# Altium schematic sheet PLL.SchDoc
size A4
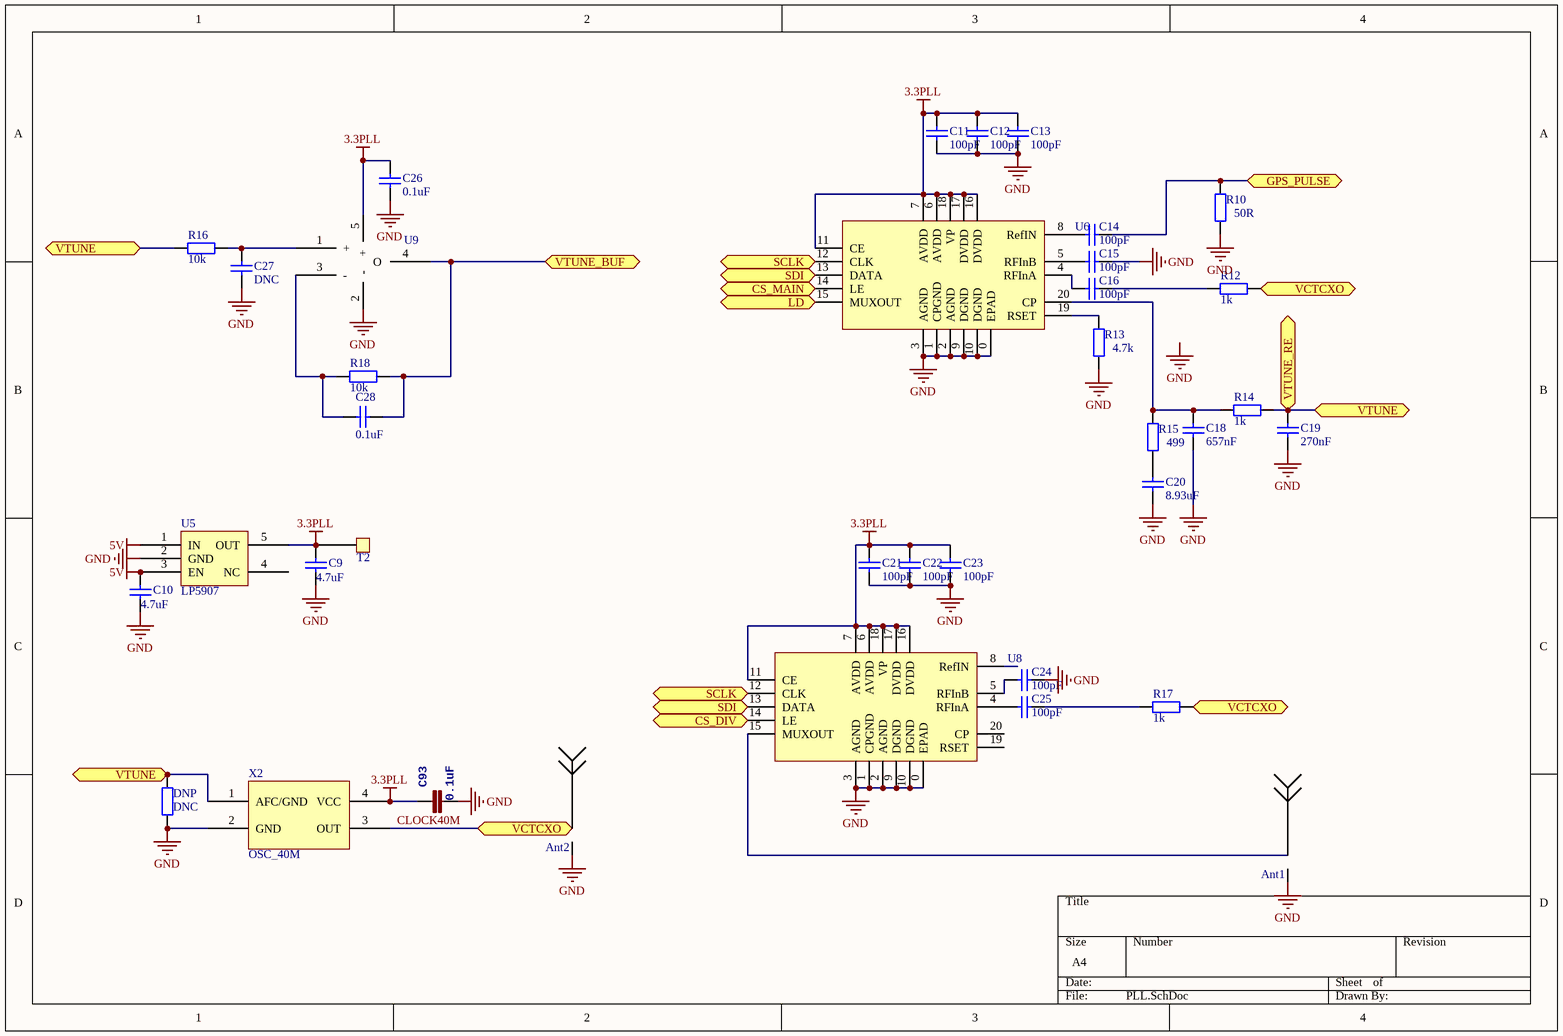
[diagram p0: PLL.SchDoc]

## Parts
Ant1  Antenna  [SMA-2]  (value not drawn)
Ant2  Antenna  [SMA-2]  (value not drawn)
C9  4.7uF  [0603]
C10  4.7uF  [0603]
C11  100pF  [0402]
C12  100pF  [0402]
C13  100pF  [0402]
C14  100pF  [0402]
C15  100pF  [0402]
C16  100pF  [0402]
C18  657nF  [0402]
C19  270nF  [0402]
C20  8.93uF  [0402]
C21  100pF  [0402]
C22  100pF  [0402]
C23  100pF  [0402]
C24  100pF  [0402]
C25  100pF  [0402]
C26  value 0.1uF  [0402]  (hidden comment: Cap)
C27  value DNC  [0402]  (hidden comment: Cap)
C28  value 0.1uF  [0402]  (hidden comment: Cap)
C93  0.1uF  [0402]
DNP  DNC  [0402]
R10  50R  [0402]
R12  1k  [0402]
R13  4.7k  [0402]
R14  1k  [0402]
R15  499  [0402]
R16  value 10k  [0402]  (hidden comment: Res2)
R17  1k  [0402]
R18  value 10k  [0402]  (hidden comment: Res2)
T2  TestPad  [TestPad - 1mm]  (value not drawn)
U5  LP5907  [SOT23-5]
U6  ADF4001  [ADF4001]  (value not drawn)
U8  ADF4001  [ADF4001]  (value not drawn)
U9  OP-SOT23  [SOT23-5]  (value not drawn)
X2  OSC_40M  [TXC_7Q]

## Ports
CS_DIV, CS_MAIN, GPS_PULSE, LD, SCLK, SDI, VCTCXO, VTUNE, VTUNE_BUF, VTUNE_RE

## Nets
3.3PLL: C9.2 C11.1 C12.1 C13.1 C21.1 C22.1 C23.1 C26.2 C93.1 T2.1 U5.5(OUT) U6.6(AVDD) U6.7(AVDD) U6.11(CE) U6.16(DVDD) U6.17(DVDD) U6.18(VP) U8.6(AVDD) U8.7(AVDD) U8.11(CE) U8.16(DVDD) U8.17(DVDD) U8.18(VP) U9.5(+) X2.4(VCC)
5V: C10.2 U5.1(IN) U5.3(EN)
GND: Ant1.GND(G) Ant2.GND(G) C9.1 C10.1 C11.2 C12.2 C13.2 C15.1 C18.2 C19.2 C20.2 C21.2 C22.2 C23.2 C24.1 C26.1 C27.2 C93.2 DNP.2 R10.1 R13.1 U5.2(GND) U6.0(EPAD) U6.1(CPGND) U6.2(AGND) U6.3(AGND) U6.9(DGND) U6.10(DGND) U8.0(EPAD) U8.1(CPGND) U8.2(AGND) U8.3(AGND) U8.9(DGND) U8.10(DGND) U9.2(-) X2.2(GND)
CLOCK40M: Ant2.1 R12.1 R17.1 X2.3(OUT) ; port VCTCXO
CS_DIV: U8.14(LE) ; port CS_DIV
CS_MAIN: U6.14(LE) ; port CS_MAIN
GPS_PULSE: C14.1 R10.2 ; port GPS_PULSE
LD: U6.15(MUXOUT) ; port LD
SCLK: U6.12(CLK) U8.12(CLK) ; port SCLK
SDI: U6.13(DATA) U8.13(DATA) ; port SDI
VTUNE: C19.1 DNP.1 R14.1 R16.2 X2.1(AFC/GND) ; port VTUNE, port VTUNE_RE
VTUNE_BUF: C28.2 R18.1 U9.4(O) ; port VTUNE_BUF
NetAnt1_1: Ant1.1 U8.15(MUXOUT)
NetC14_2: C14.2 U6.8(RefIN)
NetC15_2: C15.2 U6.5(RFInB)
NetC16_1: C16.1 R12.2
NetC16_2: C16.2 U6.4(RFInA)
NetC18_1: C18.1 R14.2 R15.2 U6.20(CP)
NetC20_1: C20.1 R15.1
NetC24_2: C24.2 U8.5(RFInB)
NetC25_1: C25.1 R17.2
NetC25_2: C25.2 U8.4(RFInA)
NetC27_1: C27.1 R16.1 U9.1(+)
NetC28_1: C28.1 R18.2 U9.3(-)
NetR13_2: R13.2 U6.19(RSET)

Not connected (* = marked no-connect by the designer): U5 4(NC); U8 8(RefIN) 19(RSET) 20(CP)

## Notes on the sheet
- Labels drawn without touching a wire or pin: GND

## Library data of the parts
C9-C16 C18-C28 = Cap: Capacitor; Published: 8-Jun-2000; LatestRevisionDate: 17-Jul-2002; LatestRevisionNote: Re-released for DXP Platform.; PackageReference: RAD-0.3; Publisher: Altium Limited; PackageDescription: Radial Cap, Thru-Hole; 2 Leads; 0.3 in Pin Spacing
C93 = CAP0402-CAP: <b>Capacitor</b> / Standard 0603 ceramic capacitor, and 0.1" leaded capacitor.; PARTNO: CC0402ZRY5V7BB104
DNP = Res2: Resistor; Value: 0Ohm; Published: 8-Jun-2000; LatestRevisionDate: 17-Jul-2002; LatestRevisionNote: Re-released for DXP Platform.; PackageReference: AXIAL-0.4; Publisher: Altium Limited; PackageDescription: Axial Device, Thru-Hole; 2 Leads; 0.4 in Pin Spacing
R10 R12-R18 = Res2: Resistor; Published: 8-Jun-2000; LatestRevisionDate: 17-Jul-2002; LatestRevisionNote: Re-released for DXP Platform.; PackageReference: AXIAL-0.4; Publisher: Altium Limited; PackageDescription: Axial Device, Thru-Hole; 2 Leads; 0.4 in Pin Spacing